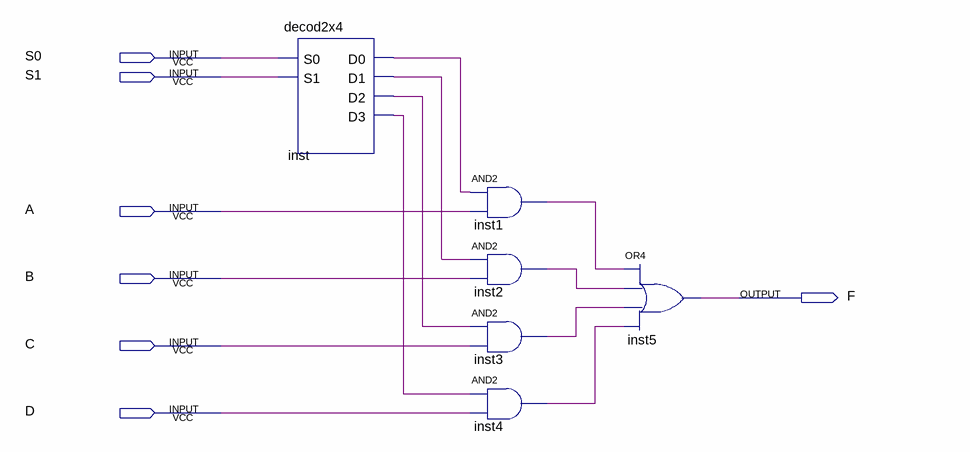
[diagram p0: schematic sheet]
// Quartus schematic mux4x1.bdf as structural Verilog: 6 symbols, 7 pins
module mux4x1 (
  input  S0,
  input  S1,
  input  A,
  input  B,
  input  C,
  input  D,
  output F
);

  wire inst1_out, inst2_out, inst3_out, inst4_out, inst_d0, inst_d1, inst_d2, inst_d3;

  decod2x4 inst (.S0(S0), .S1(S1), .D0(inst_d0), .D1(inst_d1), .D2(inst_d2), .D3(inst_d3));
  and inst1 (inst1_out, inst_d0, A);
  and inst2 (inst2_out, inst_d1, B);
  and inst3 (inst3_out, inst_d2, C);
  and inst4 (inst4_out, inst_d3, D);
  or inst5 (F, inst1_out, inst2_out, inst3_out, inst4_out);
endmodule
